# EAGLE schematic AGB_CPU-03 (EAGLE 6.5.0)
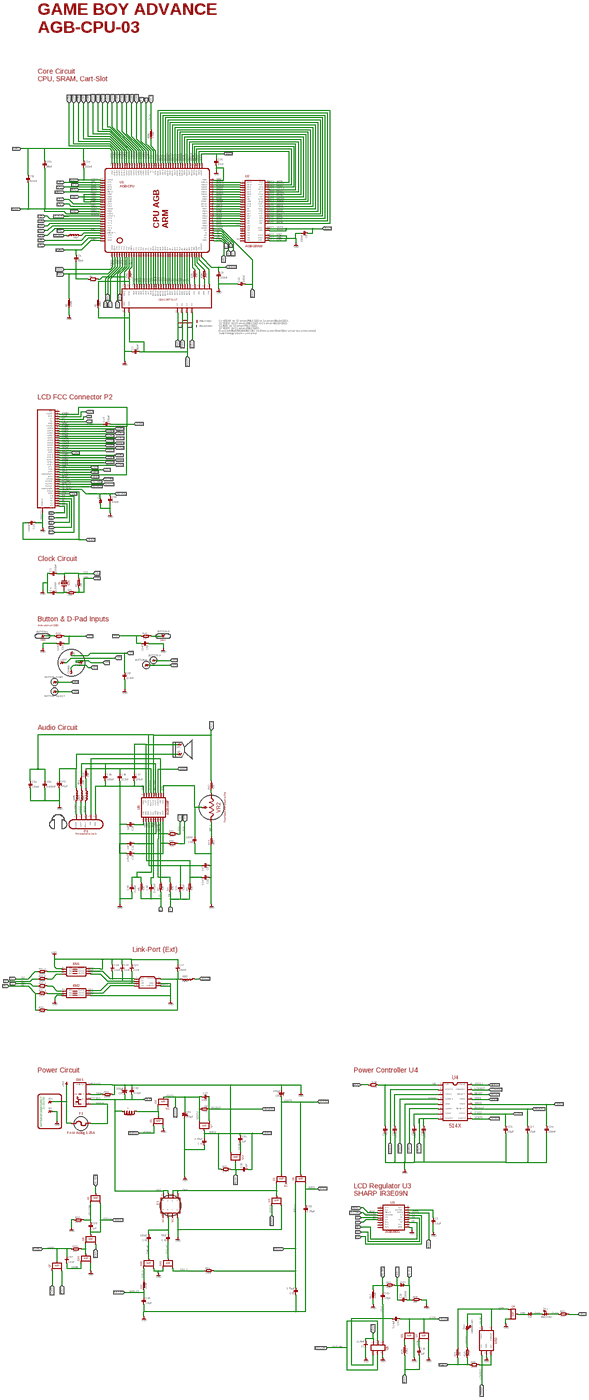
[diagram p0: schematic, sheet 1, overview]
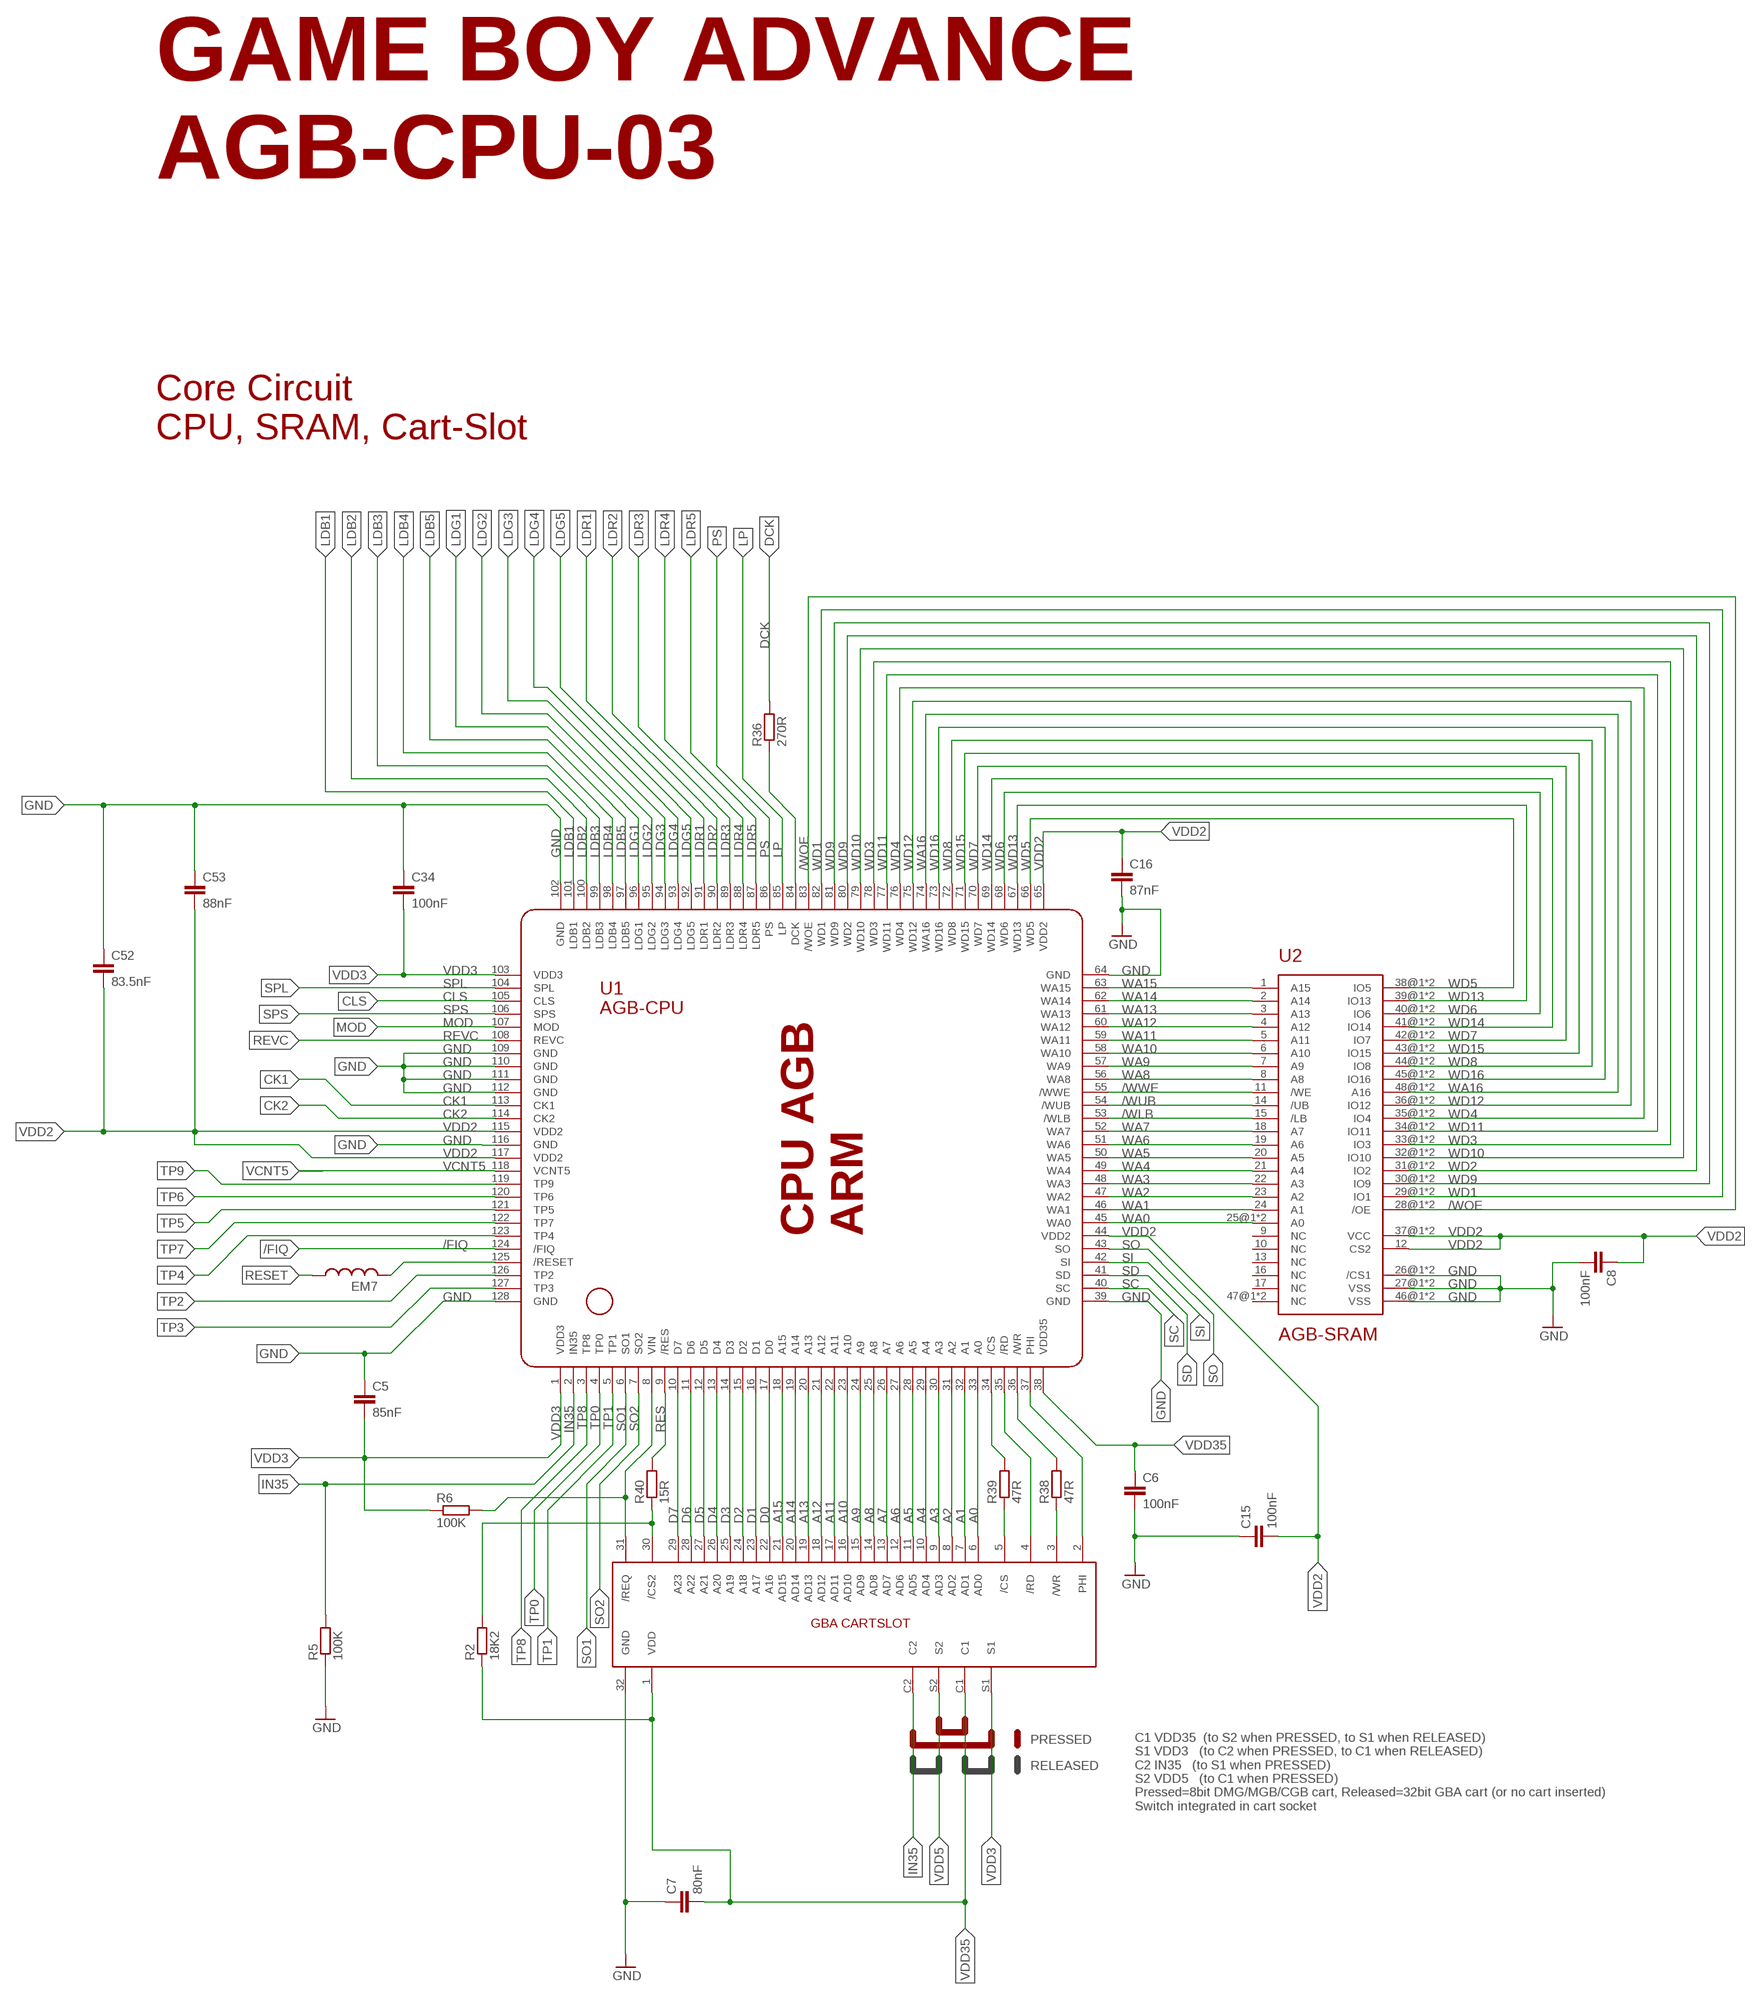
[diagram p1: schematic, sheet 1, part 1 of 5]
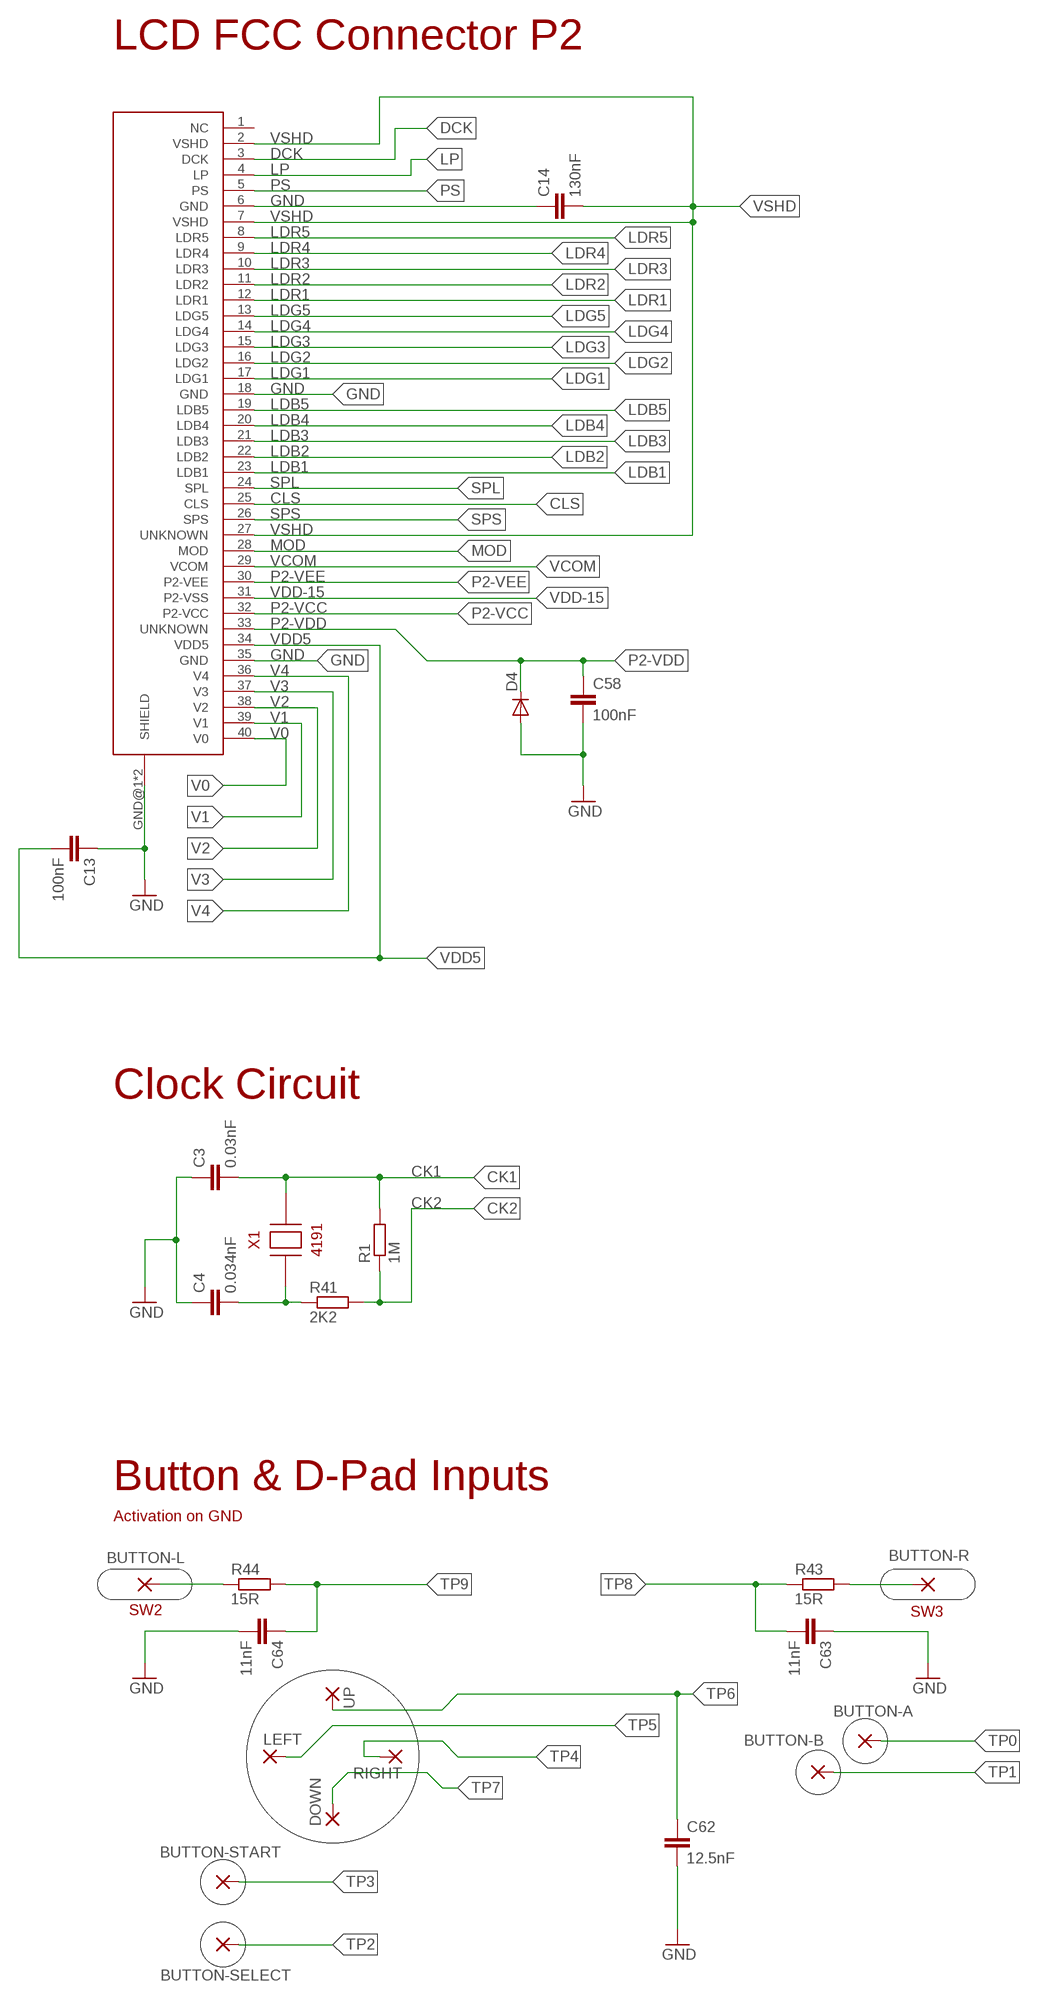
[diagram p2: schematic, sheet 1, part 2 of 5]
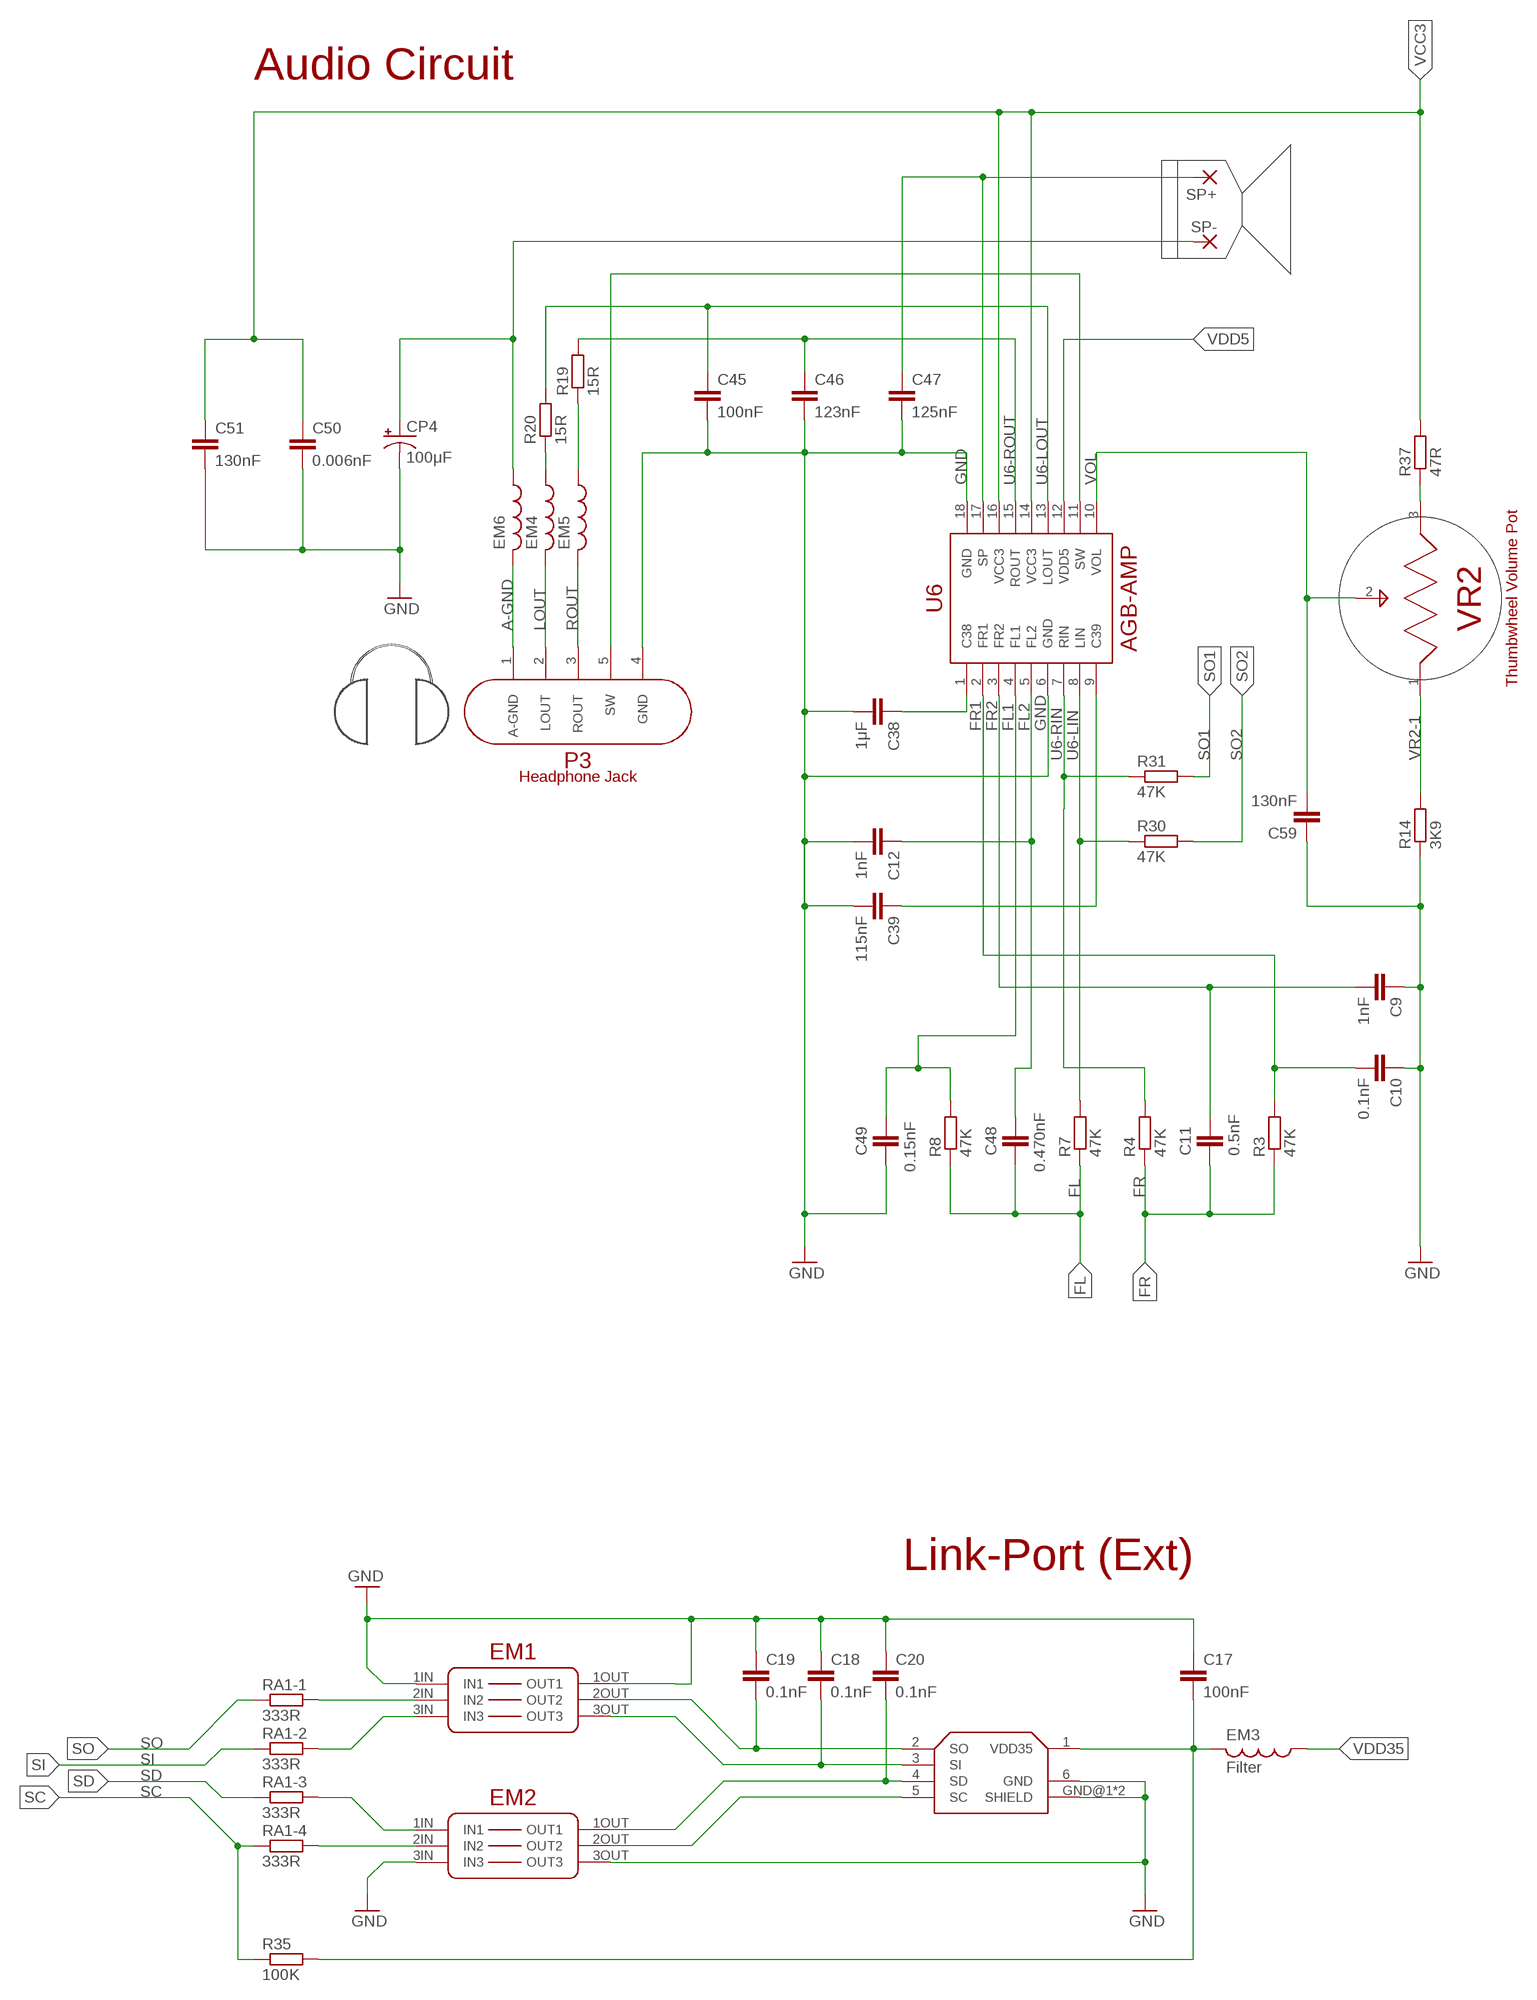
[diagram p3: schematic, sheet 1, part 3 of 5]
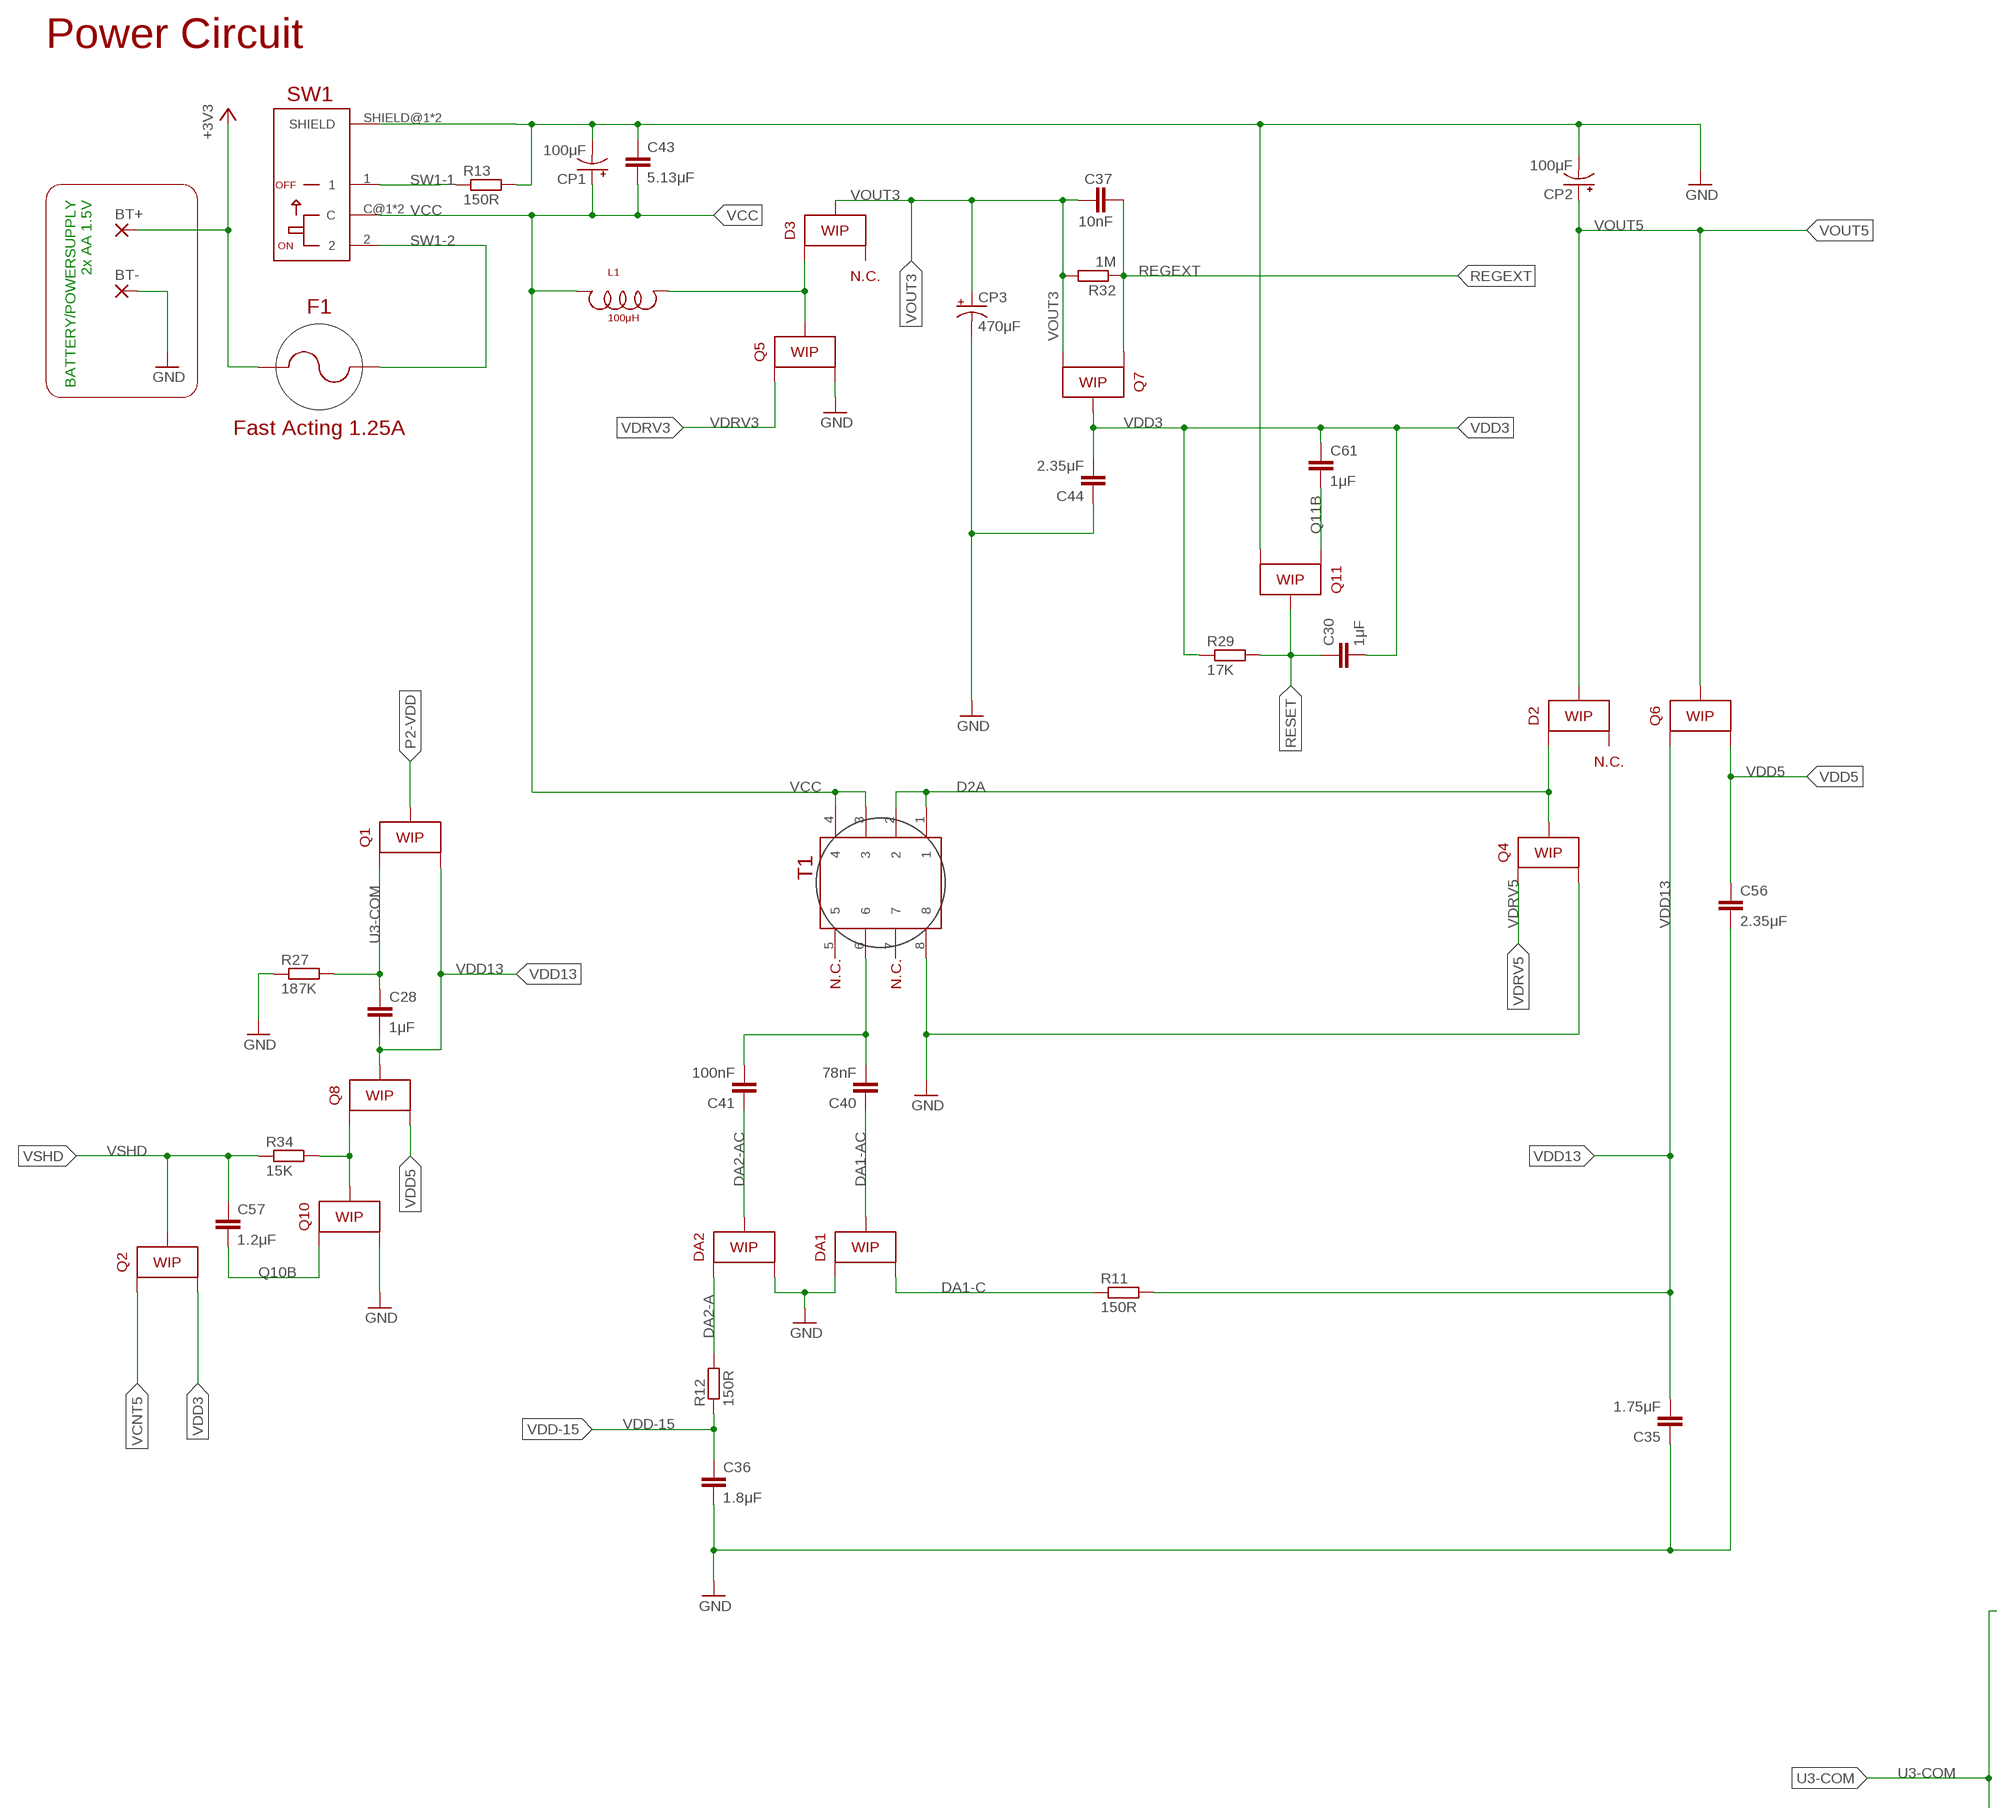
[diagram p4: schematic, sheet 1, part 4 of 5]
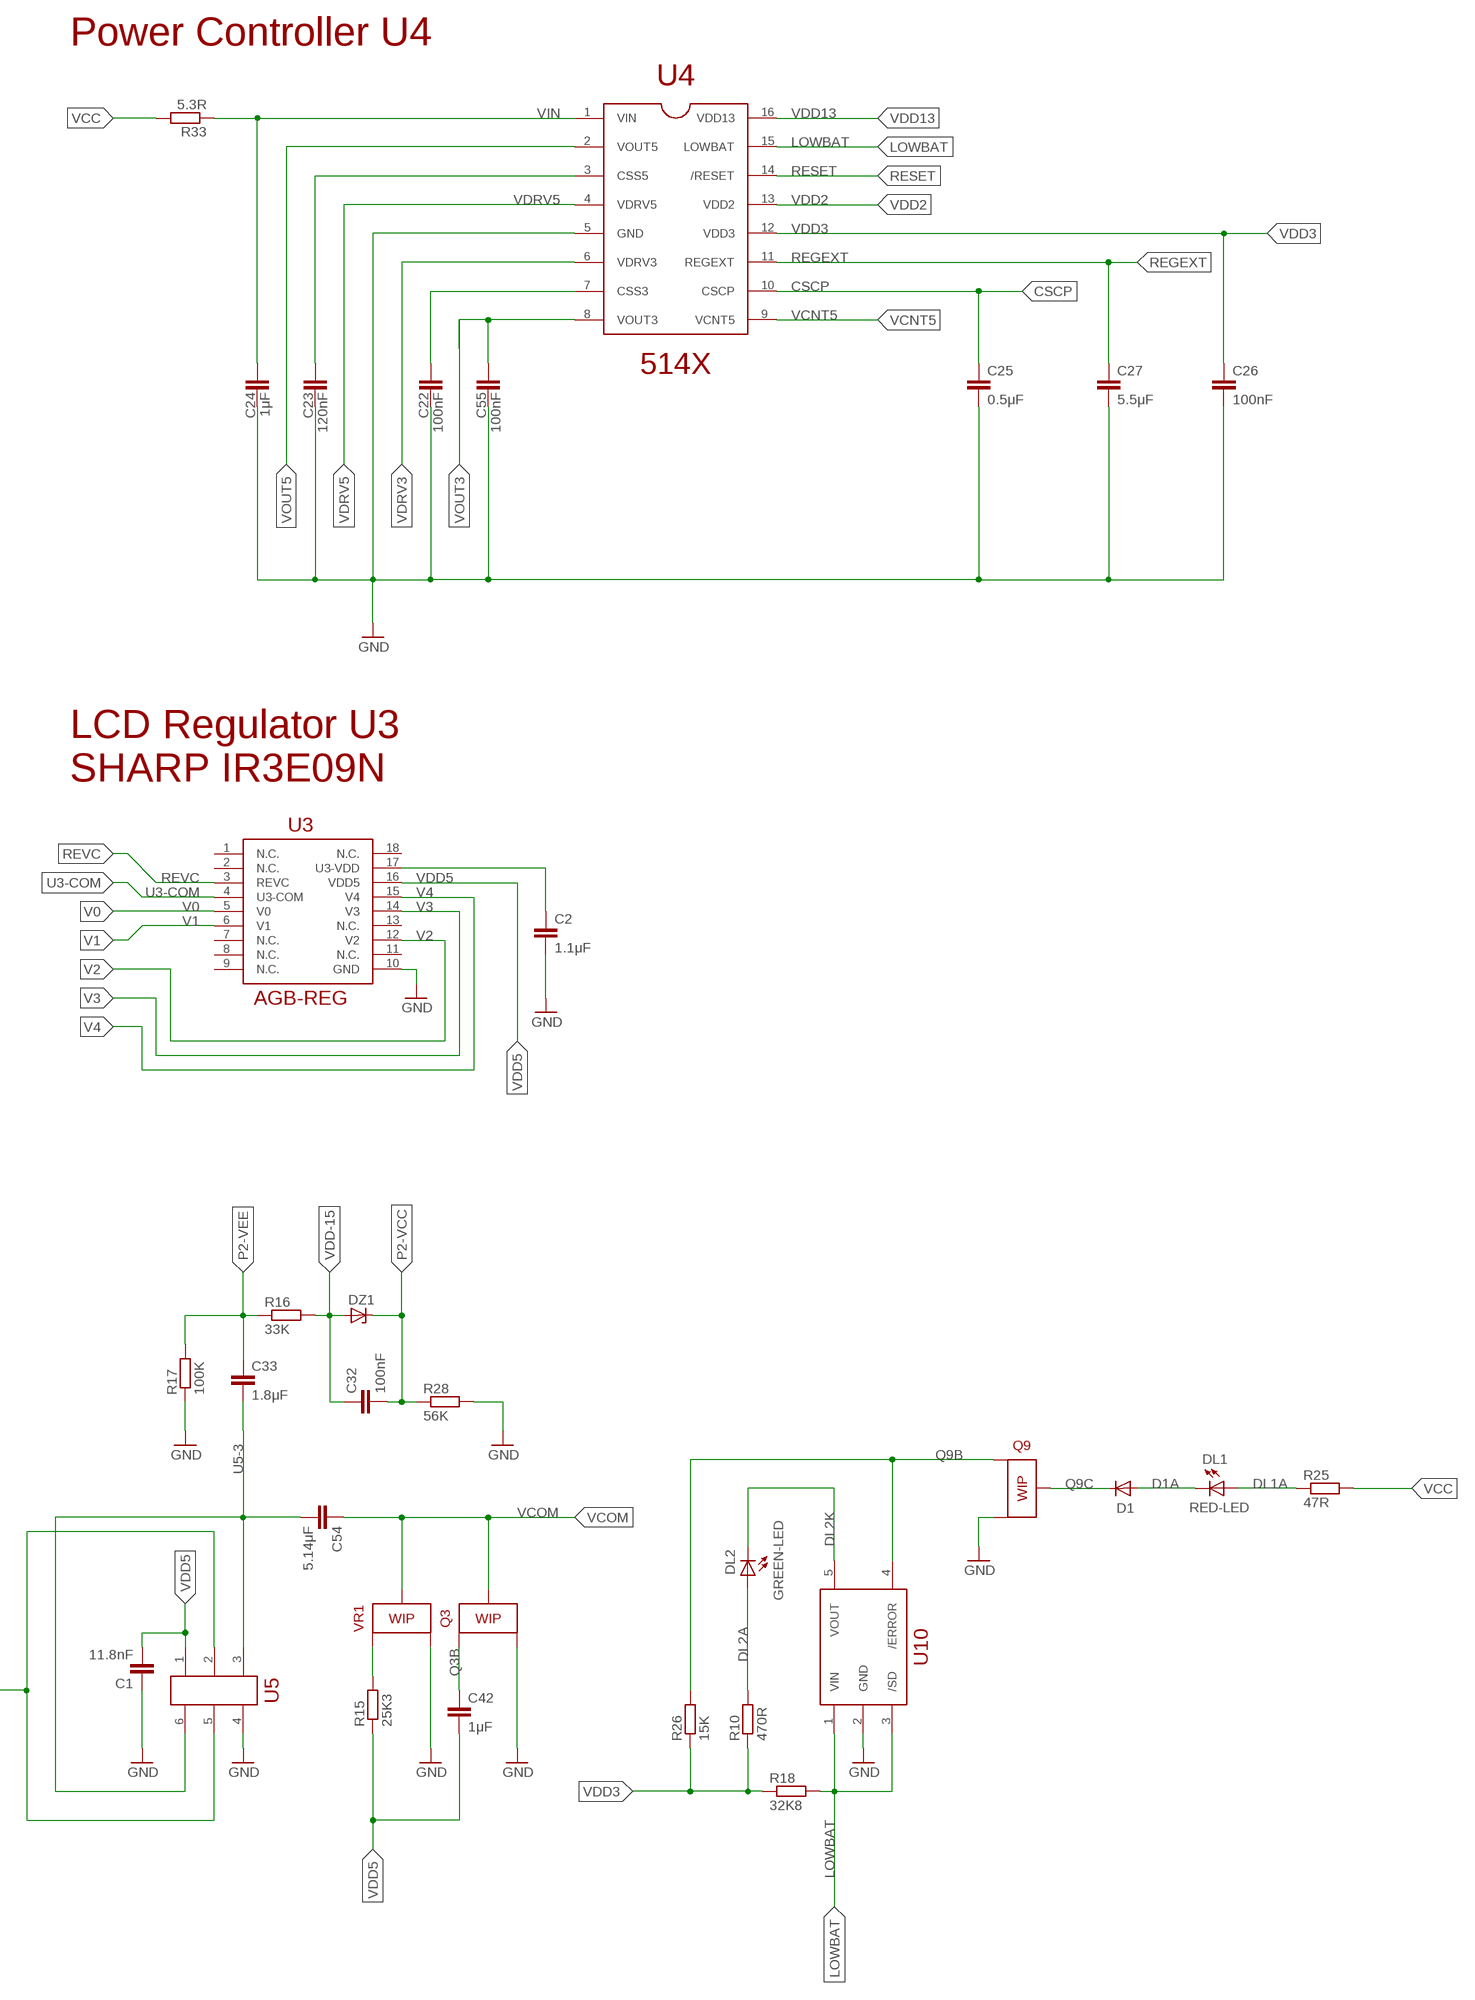
[diagram p5: schematic, sheet 1, part 5 of 5]

## Parts
BT+  WIREPAD3,81/1,4  [3,81/1,4]
BT-  WIREPAD3,81/1,4  [3,81/1,4]
BUTTON-A  WIREPAD3,81/1,4  [3,81/1,4]
BUTTON-B  WIREPAD3,81/1,4  [3,81/1,4]
BUTTON-L  WIREPAD3,81/1,4  [3,81/1,4]
BUTTON-R  WIREPAD3,81/1,4  [3,81/1,4]
BUTTON-SELECT  WIREPAD3,81/1,4  [3,81/1,4]
BUTTON-START  WIREPAD3,81/1,4  [3,81/1,4]
C1  11.8nF  C0805  [Z0805]
C2  1.1μF  C0805  [Z0805]
C3  0.03nF  C0805  [Z0805]
C4  0.034nF  C0805  [Z0805]
C5  85nF  C0805  [Z0805]
C6  100nF  C0805  [Z0805]
C7  80nF  C0805  [Z0805]
C8  100nF  C0805  [Z0805]
C9  1nF  C0805  [Z0805]
C10  0.1nF  C0805  [Z0805]
C11  0.5nF  C0805  [Z0805]
C12  1nF  C0805  [Z0805]
C13  100nF  C0805  [Z0805]
C14  130nF  C0805  [Z0805]
C15  100nF  C0805  [Z0805]
C16  87nF  C0805  [Z0805]
C17  100nF  C0805  [Z0805]
C18  0.1nF  C0805  [Z0805]
C19  0.1nF  C0805  [Z0805]
C20  0.1nF  C0805  [Z0805]
C22  100nF  C0805  [Z0805]
C23  120nF  C0805  [Z0805]
C24  1μF  C0805  [Z0805]
C25  0.5μF  C0805  [Z0805]
C26  100nF  C0805  [Z0805]
C27  5.5μF  C0805  [Z0805]
C28  1μF  C0805  [Z0805]
C30  1μF  C0805  [Z0805]
C32  100nF  C0805  [Z0805]
C33  1.8μF  C0805  [Z0805]
C34  100nF  C0805  [Z0805]
C35  1.75μF  C0805  [Z0805]
C36  1.8μF  C0805  [Z0805]
C37  10nF  C0805  [Z0805]
C38  1μF  C0805  [Z0805]
C39  115nF  C0805  [Z0805]
C40  78nF  C0805  [Z0805]
C41  100nF  C0805  [Z0805]
C42  1μF  C0805  [Z0805]
C43  5.13μF  C0805  [Z0805]
C44  2.35μF  C0805  [Z0805]
C45  100nF  C0805  [Z0805]
C46  123nF  C0805  [Z0805]
C47  125nF  C0805  [Z0805]
C48  0.470nF  C0805  [Z0805]
C49  0.15nF  C0805  [Z0805]
C50  0.006nF  C0805  [Z0805]
C51  130nF  C0805  [Z0805]
C52  83.5nF  C0805  [Z0805]
C53  88nF  C0805  [Z0805]
C54  5.14μF  C0805  [Z0805]
C55  100nF  C0805  [Z0805]
C56  2.35μF  C0805  [Z0805]
C57  1.2μF  C0805  [Z0805]
C58  100nF  C0805  [Z0805]
C59  130nF  C0805  [Z0805]
C61  1μF  C0805  [Z0805]
C62  12.5nF  C0805  [Z0805]
C63  11nF  C0805  [Z0805]
C64  11nF  C0805  [Z0805]
CP1  100μF  CPOL-USE  [PANASONIC_E]
CP2  100μF  CPOL-USE  [PANASONIC_E]
CP3  470μF  CPOL-USE  [PANASONIC_E]
CP4  100μF  CPOL-USE  [PANASONIC_E]
D1  1N4446  [DO35-10]
D2  SMD-TRANSISTOR-PLACEHOLDER  [SMD-TRANSISTOR-PLACEHOLDER]
D3  GBA-SMD-DIODE-PLACEHOLDER  [GBA-SMD-DIODE-PLACEHOLDER]
D4  1N4446  [DO35-10]
DA1  SMD-TRANSISTOR-PLACEHOLDER  [SMD-TRANSISTOR-PLACEHOLDER]
DA2  SMD-TRANSISTOR-PLACEHOLDER  [SMD-TRANSISTOR-PLACEHOLDER]
DL1  RED-LED  LAP4-TOP  [P47F-TOP]
DL2  GREEN-LED  LAP4-TOP  [P47F-TOP]
DOWN  WIREPAD3,81/1,4  [3,81/1,4]
DZ1  ZENER-DIODESOD80C  [SOD80C]
EM1  GBA-TRIPLE-EMI-FILTER  [GBA-TRIPLE-EMI-FILTER]
EM2  GBA-TRIPLE-EMI-FILTER  [GBA-TRIPLE-EMI-FILTER]
EM3  Filter  EM0805  [Z0805]
EM4  EM0805  [Z0805]
EM5  EM0805  [Z0805]
EM6  EM0805  [Z0805]
EM7  EM0805  [Z0805]
F1  Fast Acting 1.25A  F0805  [Z0805]
L1  100μH  GBA-INDUCTOR  [GBA-INDUCTOR]
LEFT  WIREPAD3,81/1,4  [3,81/1,4]
P3  GBA-HEADPHONE-JACK  [GBA-HEADPHONE-JACK]
Q1  SMD-TRANSISTOR-PLACEHOLDER  [SMD-TRANSISTOR-PLACEHOLDER]
Q2  SMD-TRANSISTOR-PLACEHOLDER  [SMD-TRANSISTOR-PLACEHOLDER]
Q3  SMD-TRANSISTOR-PLACEHOLDER  [SMD-TRANSISTOR-PLACEHOLDER]
Q4  SMD-TRANSISTOR-PLACEHOLDER  [SMD-TRANSISTOR-PLACEHOLDER]
Q5  SMD-TRANSISTOR-PLACEHOLDER  [SMD-TRANSISTOR-PLACEHOLDER]
Q6  GBA-SMD-DIODE-PLACEHOLDER  [GBA-SMD-DIODE-PLACEHOLDER]
Q7  GBA-SMD-DIODE-PLACEHOLDER  [GBA-SMD-DIODE-PLACEHOLDER]
Q8  SMD-TRANSISTOR-PLACEHOLDER  [SMD-TRANSISTOR-PLACEHOLDER]
Q9  GBA-SMD-DIODE-PLACEHOLDER  [GBA-SMD-DIODE-PLACEHOLDER]
Q10  SMD-TRANSISTOR-PLACEHOLDER  [SMD-TRANSISTOR-PLACEHOLDER]
Q11  SMD-TRANSISTOR-PLACEHOLDER  [SMD-TRANSISTOR-PLACEHOLDER]
R1  1M  R0805  [Z0805]
R2  18K2  R0805  [Z0805]
R3  47K  R0805  [Z0805]
R4  47K  R0805  [Z0805]
R5  100K  R0805  [Z0805]
R6  100K  R0805  [Z0805]
R7  47K  R0805  [Z0805]
R8  47K  R0805  [Z0805]
R10  470R  R0805  [Z0805]
R11  150R  R0805  [Z0805]
R12  150R  R0805  [Z0805]
R13  150R  R0805  [Z0805]
R14  3K9  R0805  [Z0805]
R15  25K3  R0805  [Z0805]
R16  33K  R0805  [Z0805]
R17  100K  R0805  [Z0805]
R18  32K8  R0805  [Z0805]
R19  15R  R0805  [Z0805]
R20  15R  R0805  [Z0805]
R25  47R  R0805  [Z0805]
R26  15K  R0805  [Z0805]
R27  187K  R0805  [Z0805]
R28  56K  R0805  [Z0805]
R29  17K  R0805  [Z0805]
R30  47K  R0805  [Z0805]
R31  47K  R0805  [Z0805]
R32  1M  R0805  [Z0805]
R33  5.3R  R0805  [Z0805]
R34  15K  R0805  [Z0805]
R35  100K  R0805  [Z0805]
R36  270R  R0805  [Z0805]
R37  47R  R0805  [Z0805]
R38  47R  R0805  [Z0805]
R39  47R  R0805  [Z0805]
R40  15R  R0805  [Z0805]
R41  2K2  R0805  [Z0805]
R43  15R  R0805  [Z0805]
R44  15R  R0805  [Z0805]
RA1-1  333R  R0805  [Z0805]
RA1-2  333R  R0805  [Z0805]
RA1-3  333R  R0805  [Z0805]
RA1-4  333R  R0805  [Z0805]
RIGHT  WIREPAD3,81/1,4  [3,81/1,4]
SP+  WIREPAD3,81/1,4  [3,81/1,4]
SP-  WIREPAD3,81/1,4  [3,81/1,4]
SW1  AGB-POWER-SWITCH  [AGB-POWER-SWITCH]
T1  GBA-TRANSFORMER  [GBA-TRANSFORMER]
U2  TSOP48-SRAM  [TSOP48-SRAM]
U3  AGB-REG  [AGB-REG]
U4  GBA-POWER-CONTROLLER-514X  [GBA-POWER-CONTROLLER-514X]
U5  GBA-AGB-U5  [GBA-AGB-U5]
U6  AGB-AMP  [AGB-AMP]
U10  GBA-AGB-U10  [GBA-AGB-U10]
U$1  CARTSLOT-AGB  [CARTSLOT-AGB]
U$2  CPU-AGB-LQFP128  [CPU-AGB-LQFP128]
U$3  EXT-PORT-AGB  [EXT-PORT-AGB]
U$4  GBA-LCD-CONNECTOR-40PIN  [GBA-LCD-CONNECTOR-40PIN]
UP  WIREPAD3,81/1,4  [3,81/1,4]
VR1  SMD-TRANSISTOR-PLACEHOLDER  [SMD-TRANSISTOR-PLACEHOLDER]
VR2  GBA-VOLUME-THUMBWHEEL-POT  [GBA-VOLUME-THUMBWHEEL-POT]
X1  4191  GBA-OSCILLATOR  [GBA-OSCILLATOR]

## Nets
+3V3: BT+.1(P) F1.1
/FIQ: U$2.124(/FIQ)
/WLB: U2.15(/LB) U$2.53(/WLB)
/WOE: U2.28@1(/OE) U2.28@2(/OE) U$2.83(/WOE)
/WUB: U2.14(/UB) U$2.54(/WUB)
/WWE: U2.11(/WE) U$2.55(/WWE)
A0: U$1.6(AD0) U$2.33(A0)
A1: U$1.7(AD1) U$2.32(A1)
A2: U$1.8(AD2) U$2.31(A2)
A3: U$1.9(AD3) U$2.30(A3)
A4: U$1.10(AD4) U$2.29(A4)
A5: U$1.11(AD5) U$2.28(A5)
A6: U$1.12(AD6) U$2.27(A6)
A7: U$1.13(AD7) U$2.26(A7)
A8: U$1.14(AD8) U$2.25(A8)
A9: U$1.15(AD9) U$2.24(A9)
A10: U$1.16(AD10) U$2.23(A10)
A11: U$1.17(AD11) U$2.22(A11)
A12: U$1.18(AD12) U$2.21(A12)
A13: U$1.19(AD13) U$2.20(A13)
A14: U$1.20(AD14) U$2.19(A14)
A15: U$1.21(AD15) U$2.18(A15)
A-GND: EM6.2 P3.1(A-GND)
CK1: C3.2 R1.2 U$2.113(CK1) X1.2@1 X1.2@2 X1.2@3
CK2: R1.1 R41.2 U$2.114(CK2)
CLS: U$2.105(CLS) U$4.25(CLS)
CSCP: C25.1 U4.10(CSCP)
D0: U$1.22(A16) U$2.17(D0)
D1: U$1.23(A17) U$2.16(D1)
D1A: D1.A DL1.C
D2: U$1.24(A18) U$2.15(D2)
D2A: D2.P$1 Q4.P$2 T1.1 T1.2
D3: U$1.25(A19) U$2.14(D3)
D4: U$1.26(A20) U$2.13(D4)
D5: U$1.27(A21) U$2.12(D5)
D6: U$1.28(A22) U$2.11(D6)
D7: U$1.29(A23) U$2.10(D7)
DA1-AC: C40.1 DA1.P$2
DA1-C: DA1.P$3 R11.1
DA2-A: DA2.P$1 R12.2
DA2-AC: C41.1 DA2.P$2
DCK: R36.2 U$4.3(DCK)
DCK-FROM-CPU: R36.1 U$2.84(DCK)
DL1A: DL1.A R25.1
DL2A: DL2.A R10.2
DL2K: DL2.C U10.5(VOUT)
FGND: EM2.3OUT(OUT3) U$3.6(GND) U$3.GND@1(SHIELD) U$3.GND@2(SHIELD) ; supply symbol labelled GND
FL: C48.2 R7.1 R8.1
FL1: C49.2 R8.2 U6.4(FL1)
FL2: C12.1 C48.1 U6.5(FL2)
FR: C11.2 R3.1 R4.1
FR1: C10.2 R3.2 U6.2(FR1)
FR2: C9.2 C11.1 U6.3(FR2)
GND: BT-.1(P) C1.1 C2.2 C3.1 C4.1 C5.1 C6.2 C7.1 C8.2 C9.1 C10.1 C12.2 C13.1 C14.1 C15.1 C16.2 C17.1 C18.1 C19.1 C20.1 C22.1 C23.1 C24.1 C25.2 C26.2 C27.2 C34.1 C35.1 C36.2 C38.2 C39.2 C43.1 C44.1 C45.2 C46.2 C47.2 C49.1 C50.2 C51.2 C52.1 C53.1 C55.1 C56.2 C58.2 C59.1 C62.2 C63.1 C64.2 CP1.- CP2.- CP3.- CP4.- D4.A DA1.P$1 DA2.P$3 EM1.1IN(IN1) EM1.1OUT(OUT1) EM2.3IN(IN3) P3.4(GND) Q3.P$3 Q4.P$3 Q5.P$3 Q9.P$3 Q10.P$3 Q11.P$3 R5.1 R13.2 R14.1 R17.1 R27.1 R28.2 SW1.SHIELD@1(SHIELD) SW1.SHIELD@2(SHIELD) T1.8 U2.26@1(/CS1) U2.26@2(/CS1) U2.27@1(VSS) U2.27@2(VSS) U2.46@1(VSS) U2.46@2(VSS) U3.10(GND) U4.5(GND) U5.4 U6.6(GND) U6.18(GND) U10.2(GND) U$1.32(GND) U$2.39(GND) U$2.64(GND) U$2.102(GND) U$2.109(GND) U$2.110(GND) U$2.111(GND) U$2.112(GND) U$2.116(GND) U$2.128(GND) U$4.6(GND) U$4.18(GND) U$4.35(GND) U$4.GND@1(SHIELD) U$4.GND@2(SHIELD) VR1.P$3
IN35: R5.2 U$1.C2 U$2.2(IN35)
LDB1: U$2.101(LDB1) U$4.23(LDB1)
LDB2: U$2.100(LDB2) U$4.22(LDB2)
LDB3: U$2.99(LDB3) U$4.21(LDB3)
LDB4: U$2.98(LDB4) U$4.20(LDB4)
LDB5: U$2.97(LDB5) U$4.19(LDB5)
LDG1: U$2.96(LDG1) U$4.17(LDG1)
LDG2: U$2.95(LDG2) U$4.16(LDG2)
LDG3: U$2.94(LDG3) U$4.15(LDG3)
LDG4: U$2.93(LDG4) U$4.14(LDG4)
LDG5: U$2.92(LDG5) U$4.13(LDG5)
LDR1: U$2.91(LDR1) U$4.12(LDR1)
LDR2: U$2.90(LDR2) U$4.11(LDR2)
LDR3: U$2.89(LDR3) U$4.10(LDR3)
LDR4: U$2.88(LDR4) U$4.9(LDR4)
LDR5: U$2.87(LDR5) U$4.8(LDR5)
LOUT: EM4.2 P3.2(LOUT)
LOWBAT: R18.2 U4.15(LOWBAT) U10.1(VIN) U10.3(/SD)
LP: U$2.85(LP) U$4.4(LP)
MOD: U$2.107(MOD) U$4.28(MOD)
N$1: C23.2 U4.3(CSS5)
N$2: EM1.2IN(IN2) RA1-1.2
N$3: C4.2 R41.1 X1.1@1 X1.1@2 X1.1@3
N$4: EM1.3IN(IN3) RA1-2.2
N$5: EM2.2IN(IN2) RA1-4.2
N$6: EM2.1IN(IN1) RA1-3.2
N$7: C22.2 U4.7(CSS3)
N$8: C18.2 EM1.3OUT(OUT3) U$3.3(SI)
N$9: C20.2 EM2.1OUT(OUT1) U$3.4(SD)
N$10: EM2.2OUT(OUT2) U$3.5(SC)
N$11: C17.2 EM3.2 R35.2 U$3.1(VDD35)
N$12: BUTTON-L.1(P) R44.1
N$13: D3.P$1 L1.2@1 L1.2@2 Q5.P$2
N$14: BUTTON-R.1(P) R43.2
N$15: EM7.2 U$2.125(/RESET)
N$16: R15.2 VR1.P$1
N$17: C40.2 C41.2 T1.6
N$18: R2.2 R40.1 U$1.30(/CS2)
N$19: C2.1 U3.17(U3-VDD)
N$22: Q8.P$1 Q10.P$2 R34.2
N$27: C19.2 EM1.2OUT(OUT2) U$3.2(SO)
N$29: EM4.1 R20.1
N$30: C47.1 SP+.1(P) U6.17(SP)
N$31: P3.5(SW) U6.11(SW)
N$32: CP4.+ EM6.1 SP-.1(P)
N$33: EM5.1 R19.1
N$34: R37.1 VR2.3
N$35: C38.1 U6.1(C38)
N$36: C39.1 U6.9(C39)
N$46: R6.2 U$1.31(/REQ) U$2.8(VIN)
N$47: R39.1 U$1.5(/CS)
N$48: R39.2 U$2.34(/CS)
N$49: U$1.4(/RD) U$2.35(/RD)
N$50: R38.2 U$2.36(/WR)
N$51: R38.1 U$1.3(/WR)
P2-VCC: C32.2 DZ1.C R28.1 U$4.32(P2-VCC)
P2-VDD: C58.1 D4.C Q1.P$2 U$4.33(UNKNOWN)
P2-VEE: C33.1 R16.1 R17.2 U$4.30(P2-VEE)
PHI: U$1.2(PHI) U$2.37(PHI)
PS: U$2.86(PS) U$4.5(PS)
Q3B: C42.1 Q3.P$1
Q9B: Q9.P$1 R26.2 U10.4(/ERROR)
Q9C: D1.C Q9.P$2
Q10B: C57.2 Q10.P$1
Q11B: C61.2 Q11.P$1
REGEXT: C27.1 C37.1 Q7.P$1 R32.1 U4.11(REGEXT)
RES: R40.2 U$2.9(/RES)
RESET: C30.1 EM7.1 Q11.P$2 R29.2 U4.14(/RESET)
REVC: U3.3(REVC) U$2.108(REVC)
ROUT: EM5.2 P3.3(ROUT)
SC: R35.1 RA1-4.1 U$2.40(SC)
SD: RA1-3.1 U$2.41(SD)
SI: RA1-2.1 U$2.42(SI)
SO: RA1-1.1 U$2.43(SO)
SO1: R31.2 U$2.6(SO1)
SO2: R30.2 U$2.7(SO2)
SPL: U$2.104(SPL) U$4.24(SPL)
SPS: U$2.106(SPS) U$4.26(SPS)
SW1-1: R13.1 SW1.1
SW1-2: F1.2 SW1.2
TP0: BUTTON-A.1(P) U$2.4(TP0)
TP1: BUTTON-B.1(P) U$2.5(TP1)
TP2: BUTTON-SELECT.1(P) U$2.126(TP2)
TP3: BUTTON-START.1(P) U$2.127(TP3)
TP4: RIGHT.1(P) U$2.123(TP4)
TP5: LEFT.1(P) U$2.121(TP5)
TP6: C62.1 U$2.120(TP6) UP.1(P)
TP7: DOWN.1(P) U$2.122(TP7)
TP8: C63.2 R43.1 U$2.3(TP8)
TP9: C64.1 R44.2 U$2.119(TP9)
U3-COM: C28.1 Q1.P$1 R27.2 U3.4(U3-COM) U5.2 U5.5
U5-3: C33.2 C54.2 U5.3 U5.6
U6-LIN: R7.2 R30.1 U6.8(LIN)
U6-LOUT: C45.1 R20.2 U6.13(LOUT)
U6-RIN: R4.2 R31.1 U6.7(RIN)
U6-ROUT: C46.1 R19.2 U6.15(ROUT)
V0: U3.5(V0) U$4.40(V0)
V1: U3.6(V1) U$4.39(V1)
V2: U3.12(V2) U$4.38(V2)
V3: U3.14(V3) U$4.37(V3)
V4: U3.15(V4) U$4.36(V4)
VCC: C43.2 CP1.+ L1.1@1 L1.1@2 R25.2 R33.2 SW1.C@1(C) SW1.C@2(C) T1.3 T1.4
VCC3: C50.1 C51.1 R37.2 U6.14(VCC3) U6.16(VCC3)
VCNT5: Q2.P$1 U4.9(VCNT5) U$2.118(VCNT5)
VCOM: C54.1 Q3.P$2 U$4.29(VCOM) VR1.P$2
VDD2: C8.1 C15.2 C16.1 C52.2 C53.2 U2.12(CS2) U2.37@1(VCC) U2.37@2(VCC) U4.13(VDD2) U$2.44(VDD2) U$2.65(VDD2) U$2.115(VDD2) U$2.117(VDD2)
VDD3: C5.2 C26.1 C30.2 C34.2 C44.2 C61.1 Q2.P$3 Q7.P$2 R6.1 R10.1 R18.1 R26.1 R29.1 U4.12(VDD3) U$1.S1 U$2.1(VDD3) U$2.103(VDD3)
VDD5: C1.2 C13.2 C42.2 C56.1 Q6.P$3 Q8.P$3 R15.1 U3.16(VDD5) U5.1 U6.12(VDD5) U$1.S2 U$4.34(VDD5)
VDD13: C28.2 C35.2 Q1.P$3 Q6.P$1 Q8.P$2 R11.2 U4.16(VDD13)
VDD35: C6.1 C7.2 EM3.1 R2.1 U$1.1(VDD) U$1.C1 U$2.38(VDD35)
VDD-15: C32.1 C36.1 DZ1.A R12.1 R16.2 U$4.31(P2-VSS)
VDRV3: Q5.P$1 U4.6(VDRV3)
VDRV5: Q4.P$1 U4.4(VDRV5)
VIN: C24.2 R33.1 U4.1(VIN)
VOL: C59.2 U6.10(VOL) VR2.2
VOUT3: C37.2 C55.2 CP3.+ D3.P$2 Q7.P$3 R32.2 U4.8(VOUT3)
VOUT5: CP2.+ D2.P$2 Q6.P$2 U4.2(VOUT5)
VR2-1: R14.2 VR2.1
VSHD: C14.2 C57.1 Q2.P$2 R34.1 U$4.2(VSHD) U$4.7(VSHD) U$4.27(UNKNOWN)
WA0: U2.25@1(A0) U2.25@2(A0) U$2.45(WA0)
WA1: U2.24(A1) U$2.46(WA1)
WA2: U2.23(A2) U$2.47(WA2)
WA3: U2.22(A3) U$2.48(WA3)
WA4: U2.21(A4) U$2.49(WA4)
WA5: U2.20(A5) U$2.50(WA5)
WA6: U2.19(A6) U$2.51(WA6)
WA7: U2.18(A7) U$2.52(WA7)
WA8: U2.8(A8) U$2.56(WA8)
WA9: U2.7(A9) U$2.57(WA9)
WA10: U2.6(A10) U$2.58(WA10)
WA11: U2.5(A11) U$2.59(WA11)
WA12: U2.4(A12) U$2.60(WA12)
WA13: U2.3(A13) U$2.61(WA13)
WA14: U2.2(A14) U$2.62(WA14)
WA15: U2.1(A15) U$2.63(WA15)
WA16: U2.48@1(A16) U2.48@2(A16) U$2.74(WA16)
WD1: U2.29@1(IO1) U2.29@2(IO1) U$2.82(WD1)
WD2: U2.31@1(IO2) U2.31@2(IO2) U$2.80(WD2)
WD3: U2.33@1(IO3) U2.33@2(IO3) U$2.78(WD3)
WD4: U2.35@1(IO4) U2.35@2(IO4) U$2.76(WD4)
WD5: U2.38@1(IO5) U2.38@2(IO5) U$2.66(WD5)
WD6: U2.40@1(IO6) U2.40@2(IO6) U$2.68(WD6)
WD7: U2.42@1(IO7) U2.42@2(IO7) U$2.70(WD7)
WD8: U2.44@1(IO8) U2.44@2(IO8) U$2.72(WD8)
WD9: U2.30@1(IO9) U2.30@2(IO9) U$2.81(WD9)
WD10: U2.32@1(IO10) U2.32@2(IO10) U$2.79(WD10)
WD11: U2.34@1(IO11) U2.34@2(IO11) U$2.77(WD11)
WD12: U2.36@1(IO12) U2.36@2(IO12) U$2.75(WD12)
WD13: U2.39@1(IO13) U2.39@2(IO13) U$2.67(WD13)
WD14: U2.41@1(IO14) U2.41@2(IO14) U$2.69(WD14)
WD15: U2.43@1(IO15) U2.43@2(IO15) U$2.71(WD15)
WD16: U2.45@1(IO16) U2.45@2(IO16) U$2.73(WD16)
Unconnected: D2.P$3 D3.P$3 T1.5 T1.7 U2.9(NC) U2.10(NC) U2.13(NC) U2.16(NC) U2.17(NC) U2.47@1(NC) U2.47@2(NC) U3.1(N.C.) U3.2(N.C.) U3.7(N.C.) U3.8(N.C.) U3.9(N.C.) U3.11(N.C.) U3.13(N.C.) U3.18(N.C.) U$4.1(NC)

## Notes on the sheet
- GAME BOY ADVANCE
  AGB-CPU-03
- Core Circuit
  CPU, SRAM, Cart-Slot
- U1
  AGB-CPU
- PRESSED
- RELEASED
- C1 VDD35  (to S2 when PRESSED, to S1 when RELEASED)
  S1 VDD3   (to C2 when PRESSED, to C1 when RELEASED)
  C2 IN35   (to S1 when PRESSED)
  S2 VDD5   (to C1 when PRESSED)
  Pressed=8bit DMG/MGB/CGB cart, Released=32bit GBA cart (or no cart inserted)
  Switch integrated in cart socket
- LCD FCC Connector P2
- Clock Circuit
- Button & D-Pad Inputs
- Activation on GND
- SW3
- SW2
- Audio Circuit
- Thumbwheel Volume Pot
- Headphone Jack
- Link-Port (Ext)
- Power Circuit | Power Controller U4
- BATTERY/POWERSUPPLY
  2x AA 1.5V
- N.C.
- N.C.
- LCD Regulator U3
  SHARP IR3E09N
- N.C. | N.C.

## Library data of the parts
BT+ BT- BUTTON-A BUTTON-B BUTTON-L BUTTON-R BUTTON-SELECT BUTTON-START DOWN LEFT RIGHT SP+ SP- UP = wirepad:WIREPAD: Wire PAD connect wire on PCB
C1-C20 C22-C28 C30 C32-C59 C61-C64 = arcadetv:C0805
CP1-CP4 = rcl:CPOL-US: POLARIZED CAPACITOR, American symbol
D1 D4 = diode:1N4446: DIODE high speed (Philips)
D2 DA1 DA2 Q1-Q5 Q8 Q10 Q11 VR1 = arcadetv:SMD-TRANSISTOR-PLACEHOLDER
D3 Q6 Q7 Q9 = arcadetv:GBA-SMD-DIODE-PLACEHOLDER
DL1 DL2 = led:*P4: PointLED® Enhanced Thinfilm LED TOP & BOTTOM mount LS P47F, LR P47F, LA P47F, LY P47F, LT P4SG, LB P4SG, LW P4SG Source: http://catalog.osram-os.com .. LA_LR_LS_LY_P47F_Pb_free.pdf
DZ1 = diode:ZENER-DIODE: Z-Diode
EM1 EM2 = arcadetv:GBA-TRIPLE-EMI-FILTER
EM3-EM7 = arcadetv:EM0805
F1 = arcadetv:F0805
L1 = arcadetv:GBA-INDUCTOR
P3 = arcadetv:GBA-HEADPHONE-JACK
R1-R8 R10-R20 R25-R41 R43 R44 RA1-1-RA1-4 = arcadetv:R0805
SW1 = arcadetv:AGB-POWER-SWITCH
T1 = arcadetv:GBA-TRANSFORMER
U2 = arcadetv:TSOP48-SRAM
U3 = arcadetv:AGB-REG
U4 = arcadetv:GBA-POWER-CONTROLLER-514X
U5 = arcadetv:GBA-AGB-U5
U6 = arcadetv:AGB-AMP
U10 = arcadetv:GBA-AGB-U10
U$1 = arcadetv:CARTSLOT-AGB
U$2 = arcadetv:CPU-AGB-LQFP128
U$3 = arcadetv:EXT-PORT-AGB
U$4 = arcadetv:GBA-LCD-CONNECTOR-40PIN
VR2 = arcadetv:GBA-VOLUME-THUMBWHEEL-POT
X1 = arcadetv:GBA-OSCILLATOR